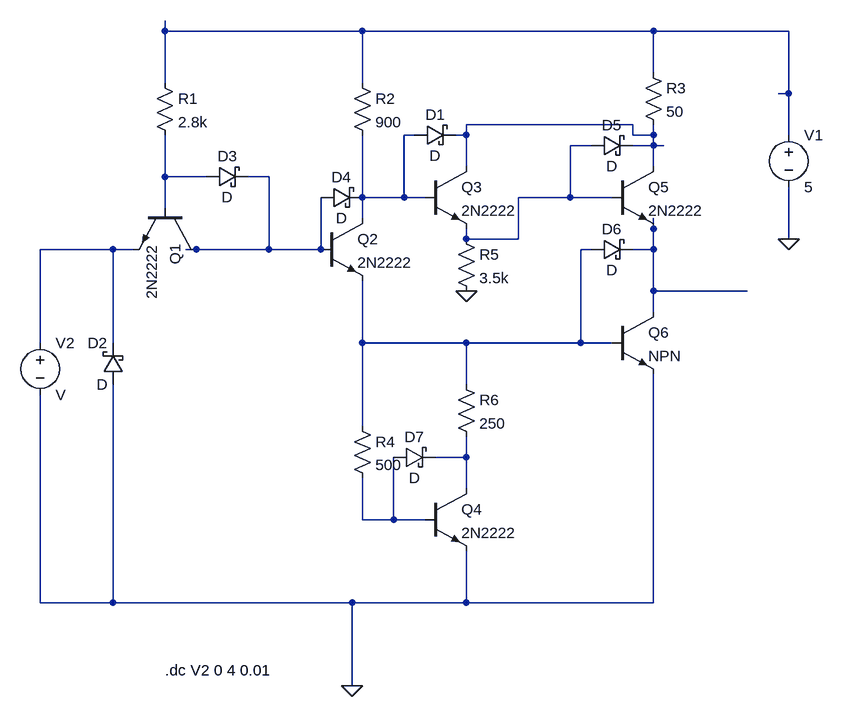
[diagram p0: schematic Draft11.asc]
Draft11.asc, the LTspice schematic file:
Version 4
SHEET 1 1356 1008
WIRE 336 -16 336 -32
WIRE 640 -16 336 -16
WIRE 1088 -16 640 -16
WIRE 1296 -16 1088 -16
WIRE 1088 48 1088 -16
WIRE 336 64 336 -16
WIRE 640 64 640 -16
WIRE 1296 80 1296 -16
WIRE 1296 80 1280 80
WIRE 1056 128 800 128
WIRE 720 144 704 144
WIRE 800 144 800 128
WIRE 800 144 784 144
WIRE 1056 144 1056 128
WIRE 1088 144 1088 128
WIRE 1088 144 1056 144
WIRE 1296 144 1296 80
WIRE 992 160 960 160
WIRE 1088 160 1088 144
WIRE 1088 160 1056 160
WIRE 1104 160 1088 160
WIRE 800 192 800 144
WIRE 1088 192 1088 160
WIRE 336 208 336 144
WIRE 400 208 336 208
WIRE 496 208 464 208
WIRE 640 240 640 144
WIRE 704 240 704 144
WIRE 704 240 640 240
WIRE 736 240 704 240
WIRE 960 240 960 160
WIRE 960 240 880 240
WIRE 1024 240 960 240
WIRE 336 256 336 208
WIRE 640 272 640 240
WIRE 1088 288 1088 272
WIRE 800 304 800 288
WIRE 880 304 880 240
WIRE 880 304 800 304
WIRE 1296 304 1296 224
WIRE 256 320 144 320
WIRE 288 320 256 320
WIRE 384 320 368 320
WIRE 496 320 496 208
WIRE 496 320 384 320
WIRE 576 320 576 240
WIRE 576 320 496 320
WIRE 992 320 976 320
WIRE 1088 320 1088 288
WIRE 1088 320 1056 320
WIRE 1088 384 1088 320
WIRE 1232 384 1088 384
WIRE 1088 416 1088 384
WIRE 144 464 144 320
WIRE 256 464 256 320
WIRE 640 464 640 368
WIRE 800 464 640 464
WIRE 976 464 976 320
WIRE 976 464 800 464
WIRE 1024 464 976 464
WIRE 800 528 800 464
WIRE 640 592 640 464
WIRE 800 640 800 608
WIRE 800 640 752 640
WIRE 800 688 800 640
WIRE 640 736 640 672
WIRE 688 736 688 640
WIRE 688 736 640 736
WIRE 736 736 688 736
WIRE 144 864 144 544
WIRE 256 864 256 528
WIRE 256 864 144 864
WIRE 624 864 256 864
WIRE 800 864 800 784
WIRE 800 864 624 864
WIRE 1088 864 1088 512
WIRE 1088 864 800 864
WIRE 624 992 624 864
FLAG 800 384 0
FLAG 624 992 0
FLAG 1296 304 0
SYMBOL npn 384 256 R90
SYMATTR InstName Q1
SYMATTR Value 2N2222
SYMBOL npn 576 272 R0
SYMATTR InstName Q2
SYMATTR Value 2N2222
SYMBOL npn 736 192 R0
SYMATTR InstName Q3
SYMATTR Value 2N2222
SYMBOL npn 736 688 R0
SYMATTR InstName Q4
SYMATTR Value 2N2222
SYMBOL npn 1024 192 R0
SYMATTR InstName Q5
SYMATTR Value 2N2222
SYMBOL npn 1024 416 R0
SYMATTR InstName Q6
SYMBOL voltage 1296 128 R0
SYMATTR InstName V1
SYMATTR Value 5
SYMBOL voltage 144 448 R0
SYMATTR InstName V2
SYMBOL schottky 720 160 R270
WINDOW 0 32 32 VTop 2
WINDOW 3 0 32 VBottom 2
SYMATTR InstName D1
SYMBOL schottky 272 528 R180
WINDOW 0 24 64 Left 2
WINDOW 3 24 0 Left 2
SYMATTR InstName D2
SYMBOL schottky 400 224 R270
WINDOW 0 32 32 VTop 2
WINDOW 3 0 32 VBottom 2
SYMATTR InstName D3
SYMBOL schottky 576 256 R270
WINDOW 0 32 32 VTop 2
WINDOW 3 0 32 VBottom 2
SYMATTR InstName D4
SYMBOL schottky 992 176 R270
WINDOW 0 32 32 VTop 2
WINDOW 3 0 32 VBottom 2
SYMATTR InstName D5
SYMBOL schottky 992 336 R270
WINDOW 0 32 32 VTop 2
WINDOW 3 0 32 VBottom 2
SYMATTR InstName D6
SYMBOL schottky 688 656 R270
WINDOW 0 32 32 VTop 2
WINDOW 3 0 32 VBottom 2
SYMATTR InstName D7
SYMBOL res 320 48 R0
SYMATTR InstName R1
SYMATTR Value 2.8k
SYMBOL res 624 48 R0
SYMATTR InstName R2
SYMATTR Value 900
SYMBOL res 1072 32 R0
SYMATTR InstName R3
SYMATTR Value 50
SYMBOL res 624 576 R0
SYMATTR InstName R4
SYMATTR Value 500
SYMBOL res 784 288 R0
SYMATTR InstName R5
SYMATTR Value 3.5k
SYMBOL res 784 512 R0
SYMATTR InstName R6
SYMATTR Value 250
TEXT 336 968 Left 2 !.dc V2 0 4 0.01

The netlist it stands for:
* Draft11.asc
Q1 N006 N005 N008 0 2N2222
Q2 N003 N006 N009 0 2N2222
Q3 N002 N003 N004 0 2N2222
Q4 N010 N011 0 0 2N2222
Q5 N002 N004 N007 0 2N2222
Q6 N007 N009 0 0 NPN
V1 N001 0 5
V2 N008 0 V
D1 N003 N002 D
D2 0 N008 D
D3 N005 N006 D
D4 N006 N003 D
D5 N004 N002 D
D6 N009 N007 D
D7 N011 N010 D
R1 N001 N005 2.8k
R2 N001 N003 900
R3 N001 N002 50
R4 N009 N011 500
R5 N004 0 3.5k
R6 N009 N010 250
.model D D
.lib standard.dio
.model NPN NPN
.model PNP PNP
.lib standard.bjt
.dc V2 0 4 0.01
.backanno
.end